# Altium schematic sheet loicpinuela2.SchDoc
size A3; SheetNumber: 2; SheetTotal: 2
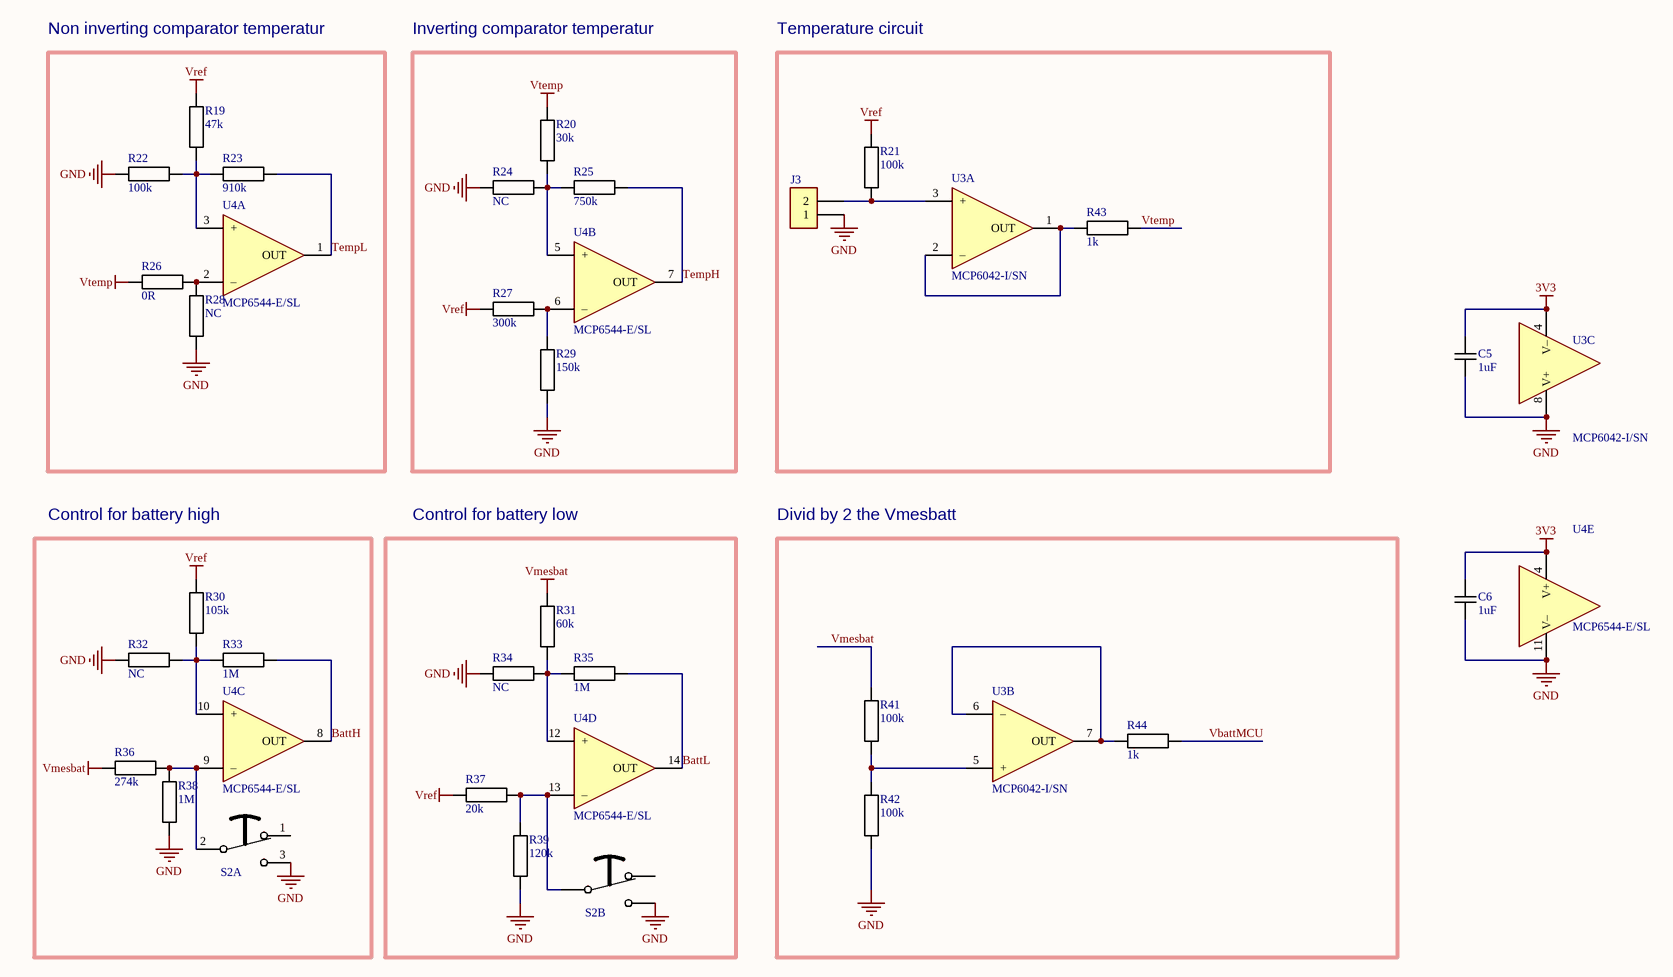
[diagram p0: loicpinuela2.SchDoc]

## Parts
C5  1uF  [CAPACITOR 2012 REFLOW]
C6  1uF  [CAPACITOR 2012 REFLOW]
J3  (no value)  [Socket1x2 P2.54]
R19  47k  [RESISTOR 2012 REFLOW]
R20  30k  [RESISTOR 2012 REFLOW]
R21  100k  [RESISTOR 2012 REFLOW]
R22  100k  [RESISTOR 2012 REFLOW]
R23  910k  [RESISTOR 2012 REFLOW]
R24  NC  [RESISTOR 2012 REFLOW]
R25  750k  [RESISTOR 2012 REFLOW]
R26  0R  [RESISTOR 2012 REFLOW]
R27  300k  [RESISTOR 2012 REFLOW]
R28  NC  [RESISTOR 2012 REFLOW]
R29  150k  [RESISTOR 2012 REFLOW]
R30  105k  [RESISTOR 2012 REFLOW]
R31  60k  [RESISTOR 2012 REFLOW]
R32  NC  [RESISTOR 2012 REFLOW]
R33  1M  [RESISTOR 2012 REFLOW]
R34  NC  [RESISTOR 2012 REFLOW]
R35  1M  [RESISTOR 2012 REFLOW]
R36  274k  [RESISTOR 2012 REFLOW]
R37  20k  [RESISTOR 2012 REFLOW]
R38  1M  [RESISTOR 2012 REFLOW]
R39  120k  [RESISTOR 2012 REFLOW]
R41  100k  [RESISTOR 2012 REFLOW]
R42  100k  [RESISTOR 2012 REFLOW]
R43  1k  [RESISTOR 2012 REFLOW]
R44  1k  [RESISTOR 2012 REFLOW]
S2  *  [Push Button E-Switch TL2233]  (value not drawn)  (parts A,B of 2)
U3  MCP6042-I/SN  [SO8 P1.27 C4.0X5.0 H1.75]  (parts A,B,C of 3)
U4  MCP6544-E/SL  [SO14 P1.27 C4.0X8.8 H1.75]  (parts A,B,C,D,E of 5)

## Blocks framed on the sheet
Non inverting comparator temperatur: R19 R22 R23 R26 R28 U4
Inverting comparator temperatur: R20 R24 R25 R27 R29 U4
Temperature circuit: J3 R21 R43 U3
Control for battery high: R30 R32 R33 R36 R38 S2 U4
Control for battery low: R31 R34 R35 R37 R39 S2 U4
Divid by 2 the Vmesbatt: R41 R42 R44 U3

## Nets
3V3: C5.2 C6.2 U3.4(V–) U4.4(V+)
GND: C5.1 C6.1 J3.1 R22.1 R24.1 R28.1 R29.2 R32.1 R34.1 R38.1 R39.2 R42.1 S2.3(NO1) S2.4(NO2) U3.8(V+) U4.11(V–)
Vmesbat: R31.2 R36.1 R41.2
Vref: R19.2 R21.2 R27.1 R30.2 R37.1
Vtemp: R20.2 R26.1 R43.2
BattH: R33.2 U4.8(OUT)
BattL: R35.2 U4.14(OUT)
TempH: R25.2 U4.7(OUT)
TempL: R23.2 U4.1(OUT)
VbattMCU: R44.2
NetJ3_2: J3.2 R21.1 U3.3(+)
NetR19_1: R19.1 R22.2 R23.1 U4.3(+)
NetR20_1: R20.1 R24.2 R25.1 U4.5(+)
NetR26_2: R26.2 R28.2 U4.2(–)
NetR27_2: R27.2 R29.1 U4.6(–)
NetR30_1: R30.1 R32.2 R33.1 U4.10(+)
NetR31_1: R31.1 R34.2 R35.1 U4.12(+)
NetR36_2: R36.2 R38.2 S2.2(COM1) U4.9(–)
NetR37_2: R37.2 R39.1 S2.5(COM2) U4.13(–)
NetR41_1: R41.1 R42.2 U3.5(+)
NetR43_1: R43.1 U3.1(OUT) U3.2(–)
NetR44_1: R44.1 U3.6(–) U3.7(OUT)

Not connected (* = marked no-connect by the designer): S2 1(NC1) 6(NC2)

## Notes on the sheet
- Date :
- Revision :
- Sheet
- of
- Design by :

## Library data of the parts
C5 C6 = Capacitor: Value: 1uF
J3 = Socket1x2: Receptacle connector
R19-R39 R41-R44 = Resistor: Tolerance: 1%
  R19: Value: 47k
  R20: Value: 30k
  R21 R22 R41 R42: Value: 100k
  R23: Value: 910k
  R24 R28 R32 R34: Value: NC
  R25: Value: 750k
  R26: Value: 0R
  R27: Value: 300k
  R29: Value: 150k
  R30: Value: 105k
  R31: Value: 60k
  R33 R35 R38: Value: 1M
  R36: Value: 274k
  R37: Value: 20k
  R39: Value: 120k
  R43 R44: Value: 1k
S2 = Push Button E-Switch TL2233: Pushbutton, DPDT, SMD Switch; Value: *
U3 = OPA DUAL: Generic dual OPA 8 pins; Value: MCP6042-I/SN
U4 = COMPARATOR QUAD OUT PIN 1-7-8-14: Generic quad comparator 14 pins, Outpout PIN 1-7-18-14; Value: MCP6544-E/SL